# Altium schematic sheet MCU.SchDoc: Drawdio MCU
size 297 x 209 mm; DocumentNumber: SP-0332; SheetNumber: 2; SheetTotal: 5
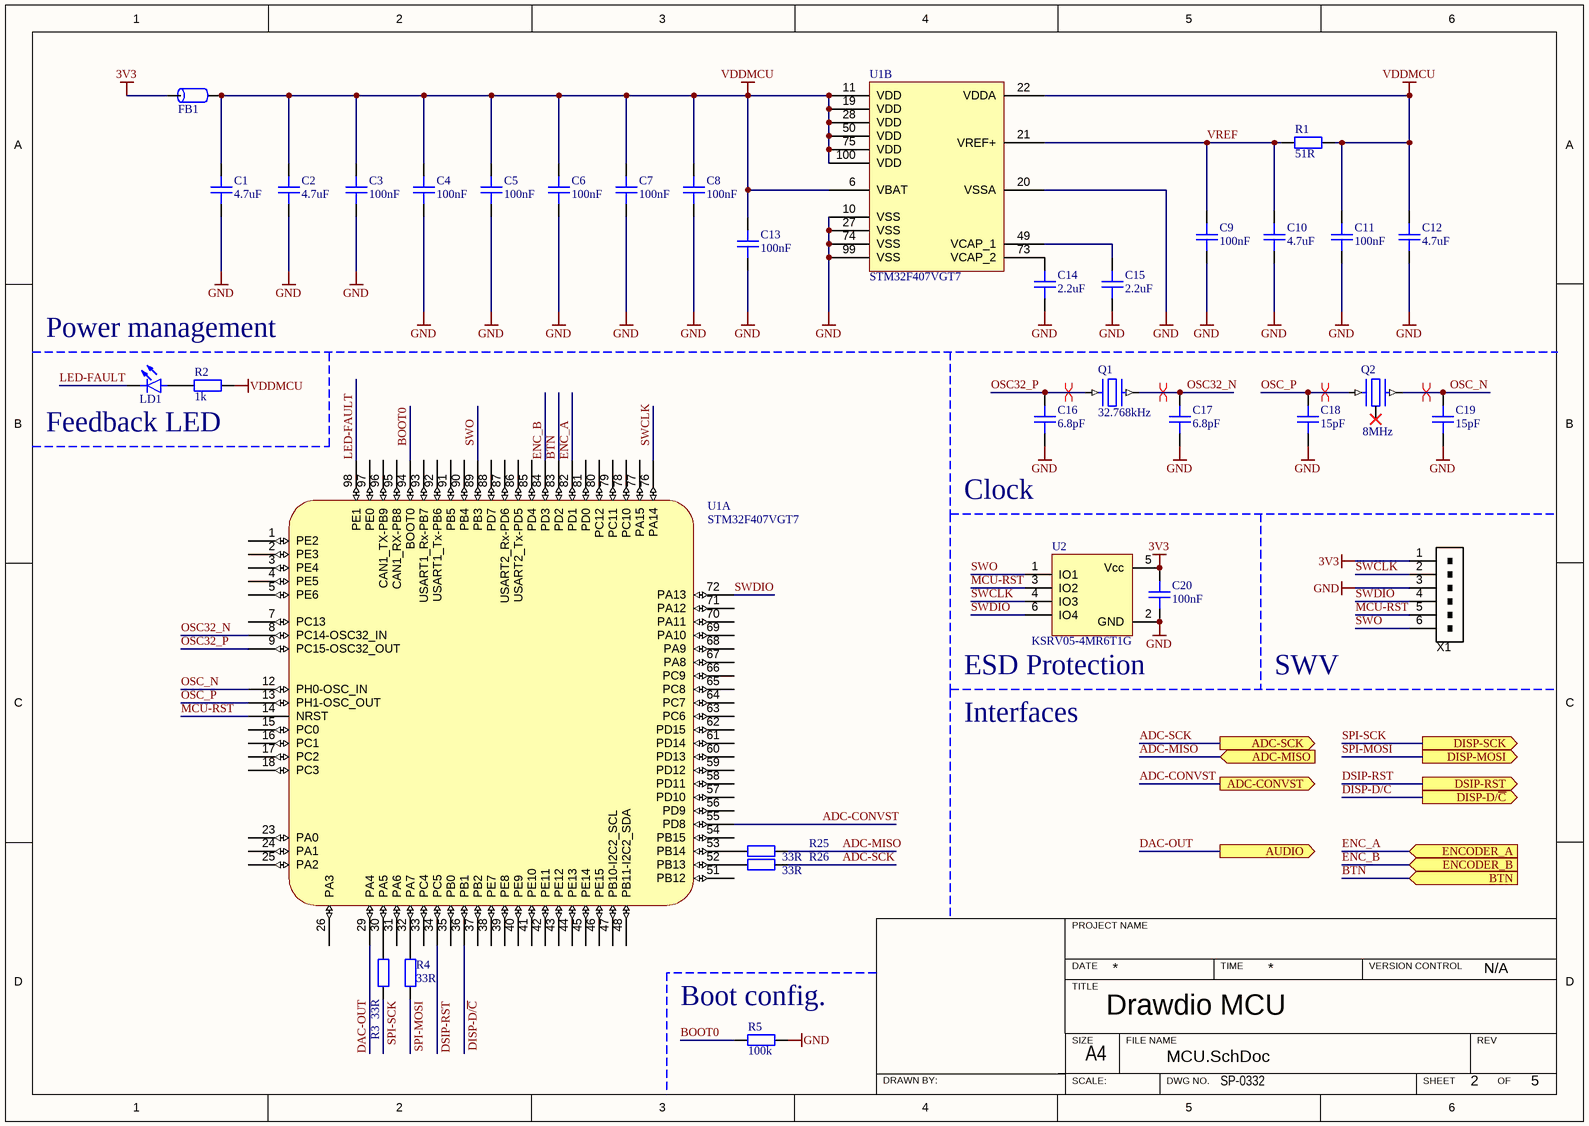
[diagram p0: MCU.SchDoc]

## Parts
C1  4.7uF  [CAP-0805]
C2  4.7uF  [CAP-0805]
C3  100nF  [CAP-0603]
C4  100nF  [CAP-0603]
C5  100nF  [CAP-0603]
C6  100nF  [CAP-0603]
C7  100nF  [CAP-0603]
C8  100nF  [CAP-0603]
C9  100nF  [CAP-0603]
C10  4.7uF  [CAP-0805]
C11  100nF  [CAP-0603]
C12  4.7uF  [CAP-0805]
C13  100nF  [CAP-0603]
C14  2.2uF  [CAP-0805]
C15  2.2uF  [CAP-0805]
C16  6.8pF  [CAP-0603]
C17  6.8pF  [CAP-0603]
C18  15pF  [CAP-0603]
C19  15pF  [CAP-0603]
C20  100nF  [CAP-0603]
FB1  FB - 0603  [FB-0603]  (value not drawn)
LD1  LED - 0603  [LED-0603]  (value not drawn)
Q1  32.768kHz  [OSC-3.2x1.5]
Q2  8MHz  [OSC-3.2x2.5]
R1  51R  [RES-0603]
R2  1k  [RES-0603]
R3  33R  [RES-0603]
R4  33R  [RES-0603]
R5  100k  [RES-0603]
R25  33R  [RES-0603]
R26  33R  [RES-0603]
U1  STM32F407VGT7  [IC-TQFP-100]  (parts A,B of 2)
U2  KSRV05-4MR6T1G  [T-SOT-23-6]
X1  CONN - SWV  [CONN-SWV-THT FEMALE]  (value not drawn)

## Ports
ADC-CONVST (out), ADC-MISO (in), ADC-SCK (out), AUDIO (out), BTN (in), DISP-D/~{C} (out), DISP-MOSI (out), DISP-SCK (out), DSIP-RST (out), ENCODER_A (in), ENCODER_B (in)

## Nets
3V3: C20.2 FB1.1 U2.5(Vcc) X1.1
GND: C1.1 C2.1 C3.1 C4.1 C5.1 C6.1 C7.1 C8.1 C9.1 C10.1 C11.1 C12.1 C13.1 C14.1 C15.1 C16.1 C17.1 C18.1 C19.1 C20.1 R5.2 U1.10(VSS) U1.20(VSSA) U1.27(VSS) U1.74(VSS) U1.99(VSS) U2.2(GND) X1.3
VDDMCU: C1.2 C2.2 C3.2 C4.2 C5.2 C6.2 C7.2 C8.2 C11.2 C12.2 C13.2 FB1.2 R1.2 R2.1 U1.6(VBAT) U1.11(VDD) U1.19(VDD) U1.22(VDDA) U1.28(VDD) U1.50(VDD) U1.75(VDD) U1.100(VDD)
ADC-CONVST: U1.55(PD8) ; port ADC-CONVST
ADC-MISO: R25.2 ; port ADC-MISO
ADC-SCK: R26.2 ; port ADC-SCK
BOOT0: R5.1 U1.94(BOOT0)
BTN: U1.83(PD2) ; port BTN
DAC-OUT: U1.29(PA4) ; port AUDIO
DISP-D/~{C}: U1.36(PB1) ; port DISP-D/~{C}
DSIP-RST: U1.34(PC5) ; port DSIP-RST
ENC_A: U1.82(PD1) ; port ENCODER_A
ENC_B: U1.84(PD3) ; port ENCODER_B
LED-FAULT: LD1.2(K) U1.98(PE1)
MCU-RST: U1.14(NRST) U2.3(IO2) X1.5
OSC32_N: C17.2 Q1.4 U1.8(PC14-OSC32_IN)
OSC32_P: C16.2 Q1.1 U1.9(PC15-OSC32_OUT)
OSC_N: C19.2 Q2.2 U1.12(PH0-OSC_IN)
OSC_P: C18.2 Q2.1 U1.13(PH1-OSC_OUT)
SPI-MOSI: R4.2 ; port DISP-MOSI
SPI-SCK: R3.2 ; port DISP-SCK
SWCLK: U1.76(PA14) U2.4(IO3) X1.2
SWDIO: U1.72(PA13) U2.6(IO4) X1.4
SWO: U1.89(PB3) U2.1(IO1) X1.6
VREF: C9.2 C10.2 R1.1 U1.21(VREF+)
NetC14_2: C14.2 U1.73(VCAP_2)
NetC15_2: C15.2 U1.49(VCAP_1)
NetLD1_1: LD1.1(A) R2.2
NetR3_1: R3.1 U1.30(PA5)
NetR4_1: R4.1 U1.32(PA7)
NetR25_1: R25.1 U1.53(PB14)
NetR26_1: R26.1 U1.52(PB13)

Not connected (* = marked no-connect by the designer): Q2 3*; U1 1(PE2) 2(PE3) 3(PE4) 4(PE5) 5(PE6) 7(PC13) 15(PC0) 16(PC1) 17(PC2) 18(PC3) 23(PA0) 24(PA1) 25(PA2) 26(PA3) 31(PA6) 33(PC4) 35(PB0) 37(PB2) 38(PE7) 39(PE8) 40(PE9) 41(PE10) 42(PE11) 43(PE12) 44(PE13) 45(PE14) 46(PE15) 47(PB10-I2C2_SCL) 48(PB11-I2C2_SDA) 51(PB12) 54(PB15) 56(PD9) 57(PD10) 58(PD11) 59(PD12) 60(PD13) 61(PD14) 62(PD15) 63(PC6) 64(PC7) 65(PC8) 66(PC9) 67(PA8) 68(PA9) 69(PA10) 70(PA11) 71(PA12) 77(PA15) 78(PC10) 79(PC11) 80(PC12) 81(PD0) 85(PD4) 86(USART2_Tx-PD5) 87(USART2_Rx-PD6) 88(PD7) 90(PB4) 91(PB5) 92(USART1_Tx-PB6) 93(USART1_Rx-PB7) 95(CAN1_RX-PB8) 96(CAN1_TX-PB9) 97(PE0)

## Layout directives
differential pair: OSC32_N, OSC32_P, OSC_N, OSC_P

## Notes on the sheet
- Power management
- Feedback LED
- Clock
- ESD Protection
- Interfaces
- SWV
- (near R5) Boot config.
- PROJECT NAME
- DATE
- TITLE
- TIME
- VERSION CONTROL
- N/A
- SIZE
- SCALE:
- A4
- FILE NAME
- DWG NO.
- SHEET
- REV
- OF
- DRAWN BY:

## Library data of the parts
C1 C2 C10 C12 C14 C15 = CAP - 0805: Capacitor Non-Polar; Distributor: *; Order number: *
  C1 C2 C10 C12: Value: 4.7uF
  C14 C15: Value: 2.2uF
C3-C9 C11 C13 C16-C20 = CAP - 0603: Capacitor Non-Polar; Distributor: *; Order number: *
  C3-C9 C11 C13 C20: Value: 100nF
  C16 C17: Value: 6.8pF
  C18 C19: Value: 15pF
FB1 = FB - 0603: Ferrit bead 0603
LD1 = LED - 0603: Single color LED; Distributor: *; Order number: *
Q1 = OSC - RTC: 32.768kHz quartz; Order number: 40-02-49; Distributor: Lomex
Q2 = OSC - MHZ SMD: 8MHz quartz; Value: 8MHz; Distributor: *; Order number: *
R1-R5 R25 R26 = RES - 0603: Resistor; Distributor: *; Order number: *
  R1: Value: 51R
  R2: Value: 1k
  R3 R4 R25 R26: Value: 33R
  R5: Value: 100k
U1 = IC - STM32F407VGxx: High-performance and DSP with FPU, ARM Cortex-M4 MCU with 1 Mbyte Flash, 168 MHz CPU, Art Accelerator, Ethernet; Order number: 2064368; Distributor: Farnell; Supplier 1: Farnell; Supplier Part Number 1: 2333298
U2 = D - KSRV05: ESD supressor, max. 28V, 150W; Order number: 100.459.44; Distributor: Hestore
X1 = CONN - SWV: SWD view and program connector; Distributor: *; Order number: *